# Altium project camera.PrjPCB
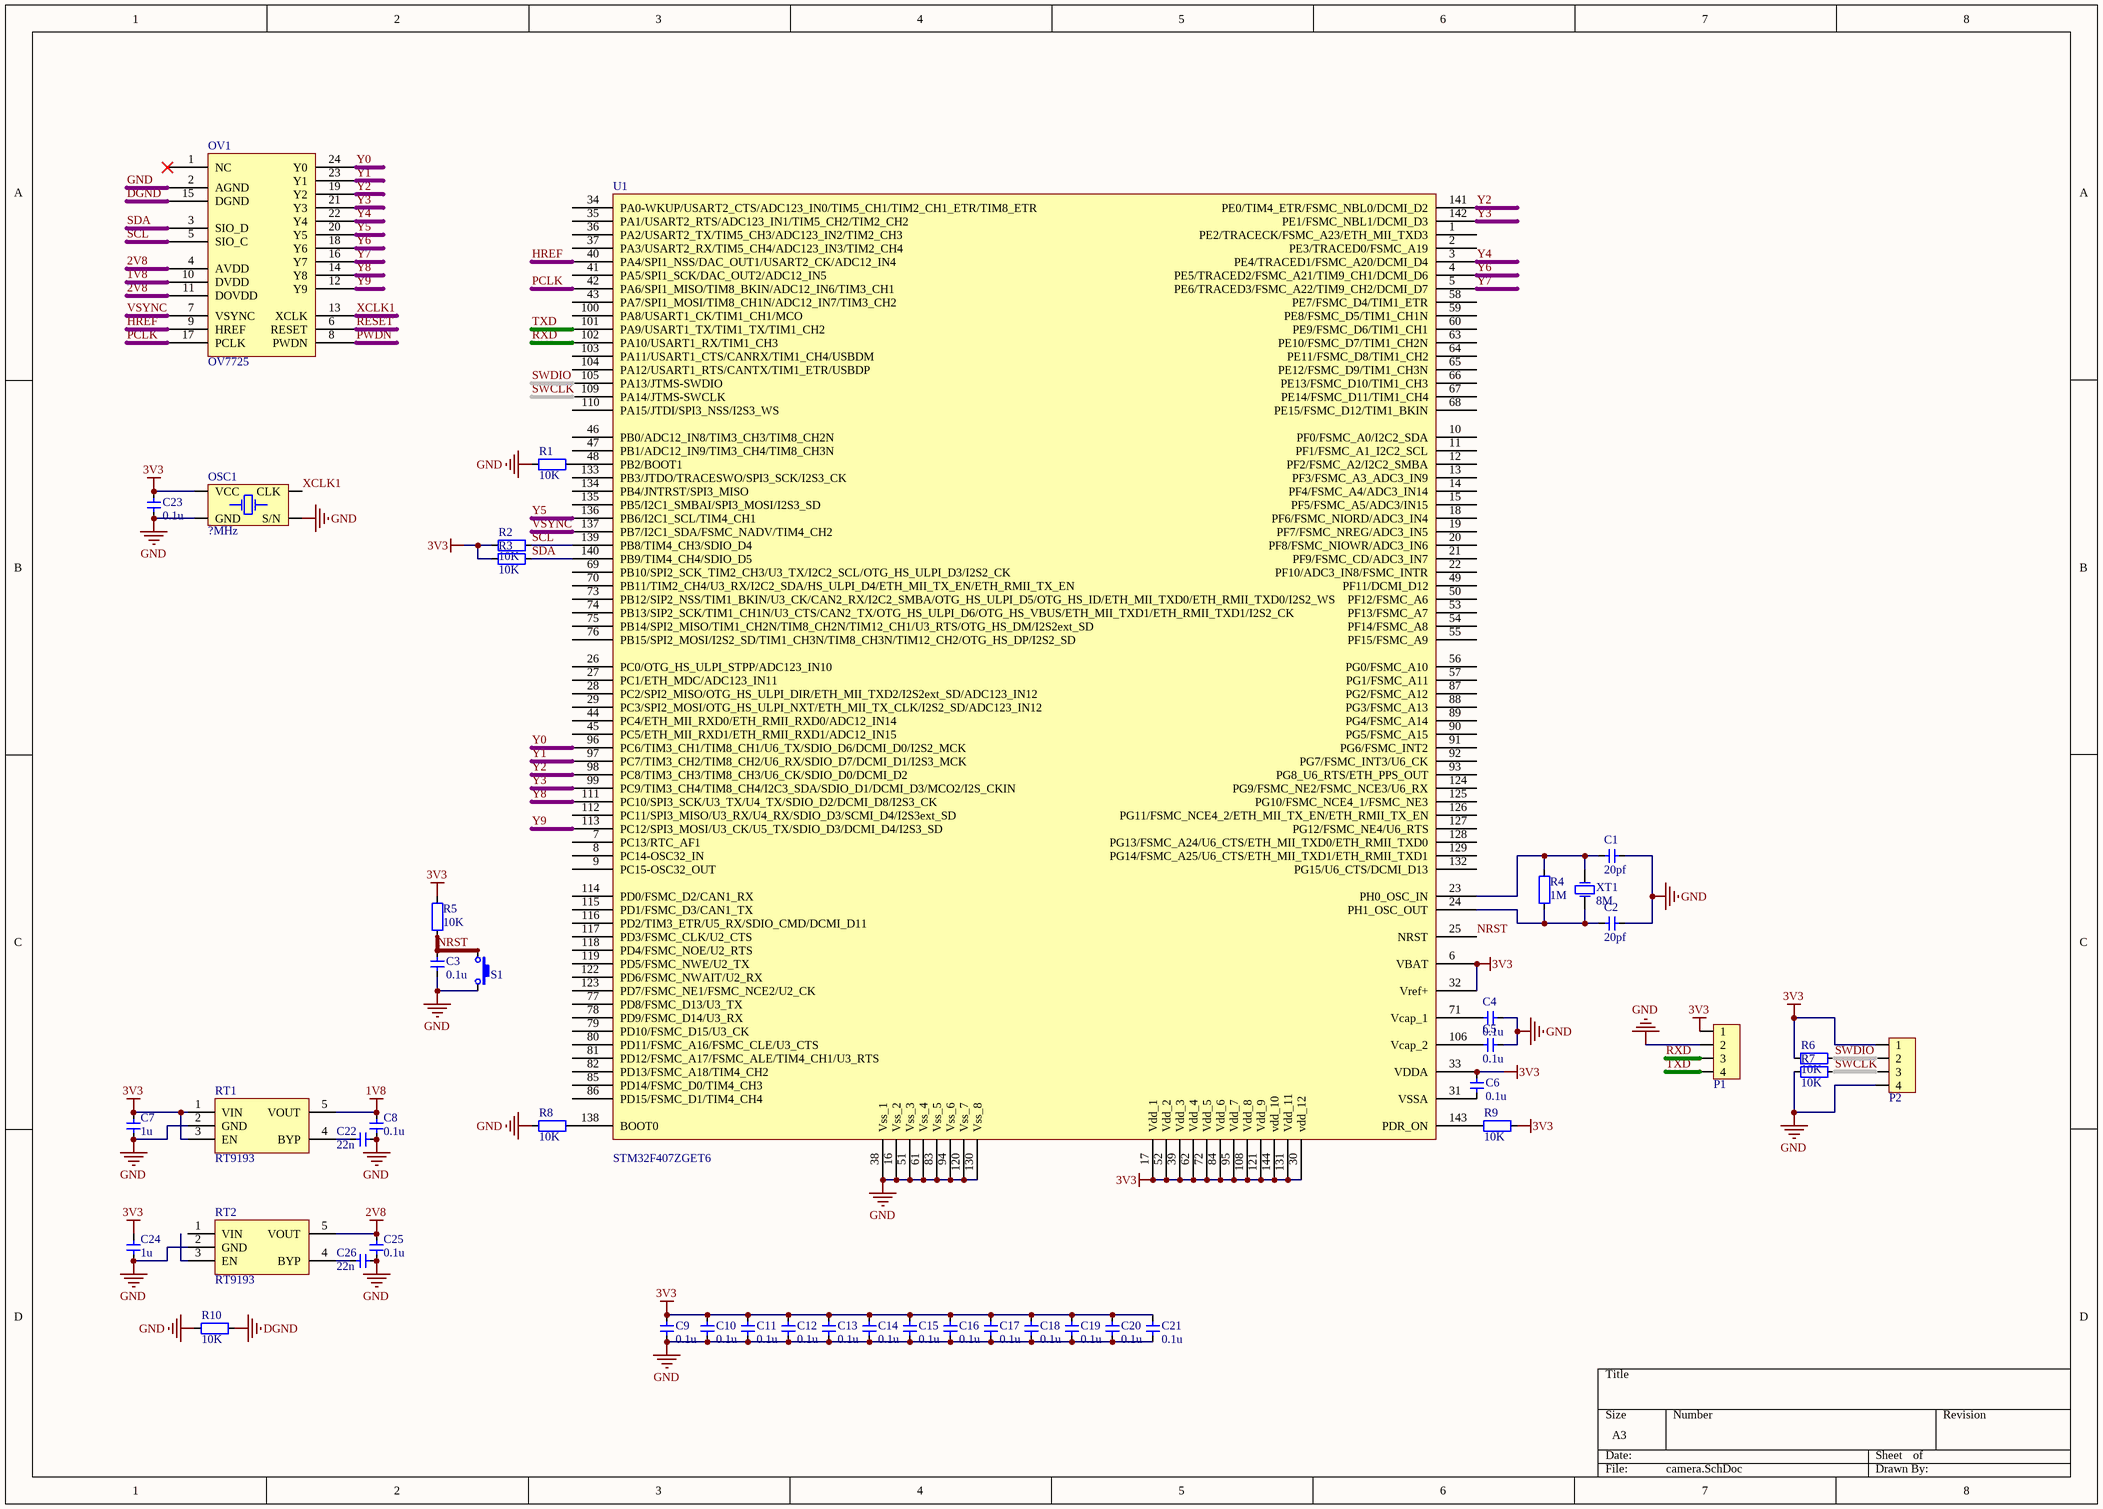
[diagram p0: camera.SchDoc]
1 sheet, 45 parts. Net scope: global (net labels, ports and power ports of the same name join across sheets).
Board file: camera.PcbDoc

## Sheet camera.SchDoc
size A3

### Parts
C1  value 20pf  [CAP_0603]  (hidden comment: Cap_0603)
C2  value 20pf  [CAP_0603]  (hidden comment: Cap_0603)
C3  value 0.1u  [CAP_0603]  (hidden comment: Cap_0603)
C4  value 0.1u  [CAP_0603]  (hidden comment: Cap_0603)
C5  value 0.1u  [CAP_0603]  (hidden comment: Cap_0603)
C6  value 0.1u  [CAP_0603]  (hidden comment: Cap_0603)
C7  value 1u  [CAP_0603]  (hidden comment: Cap_0603)
C8  value 0.1u  [CAP_0603]  (hidden comment: Cap_0603)
C9  value 0.1u  [CAP_0603]  (hidden comment: Cap_0603)
C10  value 0.1u  [CAP_0603]  (hidden comment: Cap_0603)
C11  value 0.1u  [CAP_0603]  (hidden comment: Cap_0603)
C12  value 0.1u  [CAP_0603]  (hidden comment: Cap_0603)
C13  value 0.1u  [CAP_0603]  (hidden comment: Cap_0603)
C14  value 0.1u  [CAP_0603]  (hidden comment: Cap_0603)
C15  value 0.1u  [CAP_0603]  (hidden comment: Cap_0603)
C16  value 0.1u  [CAP_0603]  (hidden comment: Cap_0603)
C17  value 0.1u  [CAP_0603]  (hidden comment: Cap_0603)
C18  value 0.1u  [CAP_0603]  (hidden comment: Cap_0603)
C19  value 0.1u  [CAP_0603]  (hidden comment: Cap_0603)
C20  value 0.1u  [CAP_0603]  (hidden comment: Cap_0603)
C21  value 0.1u  [CAP_0603]  (hidden comment: Cap_0603)
C22  value 22n  [CAP_0603]  (hidden comment: Cap_0603)
C23  value 0.1u  [CAP_0603]  (hidden comment: Cap_0603)
C24  value 1u  [CAP_0603]  (hidden comment: Cap_0603)
C25  value 0.1u  [CAP_0603]  (hidden comment: Cap_0603)
C26  value 22n  [CAP_0603]  (hidden comment: Cap_0603)
OSC1  value ?MHz  [XT_3225_4]  (hidden comment: OSC_3225_4P)
OV1  OV7725  [ov7725]
P1  HDR1x4_2.54  [HDR1X4_2.54_90]  (value not drawn)
P2  HDR1x4_2.54  [HDR1X4_2.54_90]  (value not drawn)
R1  value 10K  [RES_0603]  (hidden comment: Res_0603)
R2  value 10K  [RES_0603]  (hidden comment: Res_0603)
R3  value 10K  [RES_0603]  (hidden comment: Res_0603)
R4  value 1M  [RES_0603]  (hidden comment: Res_0603)
R5  value 10K  [RES_0603]  (hidden comment: Res_0603)
R6  value 10K  [RES_0603]  (hidden comment: Res_0603)
R7  value 10K  [RES_0603]  (hidden comment: Res_0603)
R8  value 10K  [RES_0603]  (hidden comment: Res_0603)
R9  value 10K  [RES_0603]  (hidden comment: Res_0603)
R10  value 10K  [RES_0603]  (hidden comment: Res_0603)
RT1  RT9193  [SOT23-5]
RT2  RT9193  [SOT23-5]
S1  ButtonTACT_3x4x2_180  [ButtonTACT_3x4x2_180H]  (value not drawn)
U1  STM32F407ZGET6  [LQFP_P0.5_144]
XT1  value 8M  [XT_5032_2]  (hidden comment: XTAL_5032_2P)

### Nets
1V8: C8.2 OV1.10(DVDD) RT1.5(VOUT)
2V8: C25.2 OV1.4(AVDD) OV1.11(DOVDD) RT2.5(VOUT)
3V3: C6.1 C7.2 C9.2 C10.2 C11.2 C12.2 C13.2 C14.2 C15.2 C16.2 C17.2 C18.2 C19.2 C20.2 C21.2 C23.2 C24.2 OSC1.4(VCC) P1.1 P2.1 R2.1 R3.1 R5.1 R6.2 R9.2 RT1.1(VIN) RT1.3(EN) U1.6(VBAT) U1.17(Vdd_1) U1.30(vdd_12) U1.32(Vref+) U1.33(VDDA) U1.39(Vdd_3) U1.52(Vdd_2) U1.62(Vdd_4) U1.72(Vdd_5) U1.84(Vdd_6) U1.95(Vdd_7) U1.108(Vdd_8) U1.121(Vdd_9) U1.131(Vdd_11) U1.144(vdd_10)
DGND: OV1.15(DGND) R10.2
GND: C1.1 C2.1 C3.1 C4.1 C5.1 C7.1 C8.1 C9.1 C10.1 C11.1 C12.1 C13.1 C14.1 C15.1 C16.1 C17.1 C18.1 C19.1 C20.1 C21.1 C22.1 C23.1 C24.1 C25.1 C26.1 OSC1.1(S/N) OSC1.2(GND) OV1.2(AGND) P1.2 P2.4 R1.2 R7.2 R8.1 R10.1 RT1.2(GND) RT2.2(GND) S1.2 U1.16(Vss_2) U1.38(Vss_1) U1.51(Vss_3) U1.61(Vss_4) U1.83(Vss_5) U1.94(Vss_6) U1.120(Vss_7) U1.130(Vss_8)
HREF: OV1.9(HREF) U1.40(PA4/SPI1_NSS/DAC_OUT1/USART2_CK/ADC12_IN4)
NRST: C3.2 R5.2 S1.1 U1.25(NRST)
PCLK: OV1.17(PCLK) U1.42(PA6/SPI1_MISO/TIM8_BKIN/ADC12_IN6/TIM3_CH1)
PWDN: OV1.8(PWDN)
RESET: OV1.6(RESET)
RXD: P1.3 U1.102(PA10/USART1_RX/TIM1_CH3)
SCL: OV1.5(SIO_C) R2.2 U1.139(PB8/TIM4_CH3/SDIO_D4)
SDA: OV1.3(SIO_D) R3.2 U1.140(PB9/TIM4_CH4/SDIO_D5)
SWCLK: P2.3 R7.1 U1.109(PA14/JTMS-SWCLK)
SWDIO: P2.2 R6.1 U1.105(PA13/JTMS-SWDIO)
TXD: P1.4 U1.101(PA9/USART1_TX/TIM1_TX/TIM1_CH2)
VSYNC: OV1.7(VSYNC) U1.137(PB7/I2C1_SDA/FSMC_NADV/TIM4_CH2)
XCLK1: OSC1.3(CLK) OV1.13(XCLK)
Y0: OV1.24(Y0) U1.96(PC6/TIM3_CH1/TIM8_CH1/U6_TX/SDIO_D6/DCMI_D0/I2S2_MCK)
Y1: OV1.23(Y1) U1.97(PC7/TIM3_CH2/TIM8_CH2/U6_RX/SDIO_D7/DCMI_D1/I2S3_MCK)
Y2: OV1.19(Y2) U1.98(PC8/TIM3_CH3/TIM8_CH3/U6_CK/SDIO_D0/DCMI_D2) U1.141(PE0/TIM4_ETR/FSMC_NBL0/DCMI_D2)
Y3: OV1.21(Y3) U1.99(PC9/TIM3_CH4/TIM8_CH4/I2C3_SDA/SDIO_D1/DCMI_D3/MCO2/I2S_CKIN) U1.142(PE1/FSMC_NBL1/DCMI_D3)
Y4: OV1.22(Y4) U1.3(PE4/TRACED1/FSMC_A20/DCMI_D4)
Y5: OV1.20(Y5) U1.136(PB6/I2C1_SCL/TIM4_CH1)
Y6: OV1.18(Y6) U1.4(PE5/TRACED2/FSMC_A21/TIM9_CH1/DCMI_D6)
Y7: OV1.16(Y7) U1.5(PE6/TRACED3/FSMC_A22/TIM9_CH2/DCMI_D7)
Y8: OV1.14(Y8) U1.111(PC10/SPI3_SCK/U3_TX/U4_TX/SDIO_D2/DCMI_D8/I2S3_CK)
Y9: OV1.12(Y9) U1.113(PC12/SPI3_MOSI/U3_CK/U5_TX/SDIO_D3/DCMI_D4/I2S3_SD)
NetC1_2: C1.2 R4.1 U1.23(PH0_OSC_IN) XT1.1(OSC1)
NetC2_2: C2.2 R4.2 U1.24(PH1_OSC_OUT) XT1.2(OSC2)
NetC4_2: C4.2 U1.71(Vcap_1)
NetC5_2: C5.2 U1.106(Vcap_2)
NetC6_2: C6.2 U1.31(VSSA)
NetC22_2: C22.2 RT1.4(BYP)
NetC26_2: C26.2 RT2.4(BYP)
NetR1_1: R1.1 U1.48(PB2/BOOT1)
NetR8_2: R8.2 U1.138(BOOT0)
NetR9_1: R9.1 U1.143(PDR_ON)

Not connected (* = marked no-connect by the designer): OV1 1(NC)*; RT2 1(VIN) 3(EN); U1 1(PE2/TRACECK/FSMC_A23/ETH_MII_TXD3) 2(PE3/TRACED0/FSMC_A19) 7(PC13/RTC_AF1) 8(PC14-OSC32_IN) 9(PC15-OSC32_OUT) 10(PF0/FSMC_A0/I2C2_SDA) 11(PF1/FSMC_A1_I2C2_SCL) 12(PF2/FSMC_A2/I2C2_SMBA) 13(PF3/FSMC_A3_ADC3_IN9) 14(PF4/FSMC_A4/ADC3_IN14) 15(PF5/FSMC_A5/ADC3/IN15) 18(PF6/FSMC_NIORD/ADC3_IN4) 19(PF7/FSMC_NREG/ADC3_IN5) 20(PF8/FSMC_NIOWR/ADC3_IN6) 21(PF9/FSMC_CD/ADC3_IN7) 22(PF10/ADC3_IN8/FSMC_INTR) 26(PC0/OTG_HS_ULPI_STPP/ADC123_IN10) 27(PC1/ETH_MDC/ADC123_IN11) 28(PC2/SPI2_MISO/OTG_HS_ULPI_DIR/ETH_MII_TXD2/I2S2ext_SD/ADC123_IN12) 29(PC3/SPI2_MOSI/OTG_HS_ULPI_NXT/ETH_MII_TX_CLK/I2S2_SD/ADC123_IN12) 34(PA0-WKUP/USART2_CTS/ADC123_IN0/TIM5_CH1/TIM2_CH1_ETR/TIM8_ETR) 35(PA1/USART2_RTS/ADC123_IN1/TIM5_CH2/TIM2_CH2) 36(PA2/USART2_TX/TIM5_CH3/ADC123_IN2/TIM2_CH3) 37(PA3/USART2_RX/TIM5_CH4/ADC123_IN3/TIM2_CH4) 41(PA5/SPI1_SCK/DAC_OUT2/ADC12_IN5) 43(PA7/SPI1_MOSI/TIM8_CH1N/ADC12_IN7/TIM3_CH2) 44(PC4/ETH_MII_RXD0/ETH_RMII_RXD0/ADC12_IN14) 45(PC5/ETH_MII_RXD1/ETH_RMII_RXD1/ADC12_IN15) 46(PB0/ADC12_IN8/TIM3_CH3/TIM8_CH2N) 47(PB1/ADC12_IN9/TIM3_CH4/TIM8_CH3N) 49(PF11/DCMI_D12) 50(PF12/FSMC_A6) 53(PF13/FSMC_A7) 54(PF14/FSMC_A8) 55(PF15/FSMC_A9) 56(PG0/FSMC_A10) 57(PG1/FSMC_A11) 58(PE7/FSMC_D4/TIM1_ETR) 59(PE8/FSMC_D5/TIM1_CH1N) 60(PE9/FSMC_D6/TIM1_CH1) 63(PE10/FSMC_D7/TIM1_CH2N) 64(PE11/FSMC_D8/TIM1_CH2) 65(PE12/FSMC_D9/TIM1_CH3N) 66(PE13/FSMC_D10/TIM1_CH3) 67(PE14/FSMC_D11/TIM1_CH4) 68(PE15/FSMC_D12/TIM1_BKIN) 69(PB10/SPI2_SCK_TIM2_CH3/U3_TX/I2C2_SCL/OTG_HS_ULPI_D3/I2S2_CK) 70(PB11/TIM2_CH4/U3_RX/I2C2_SDA/HS_ULPI_D4/ETH_MII_TX_EN/ETH_RMII_TX_EN) 73(PB12/SIP2_NSS/TIM1_BKIN/U3_CK/CAN2_RX/I2C2_SMBA/OTG_HS_ULPI_D5/OTG_HS_ID/ETH_MII_TXD0/ETH_RMII_TXD0/I2S2_WS) 74(PB13/SIP2_SCK/TIM1_CH1N/U3_CTS/CAN2_TX/OTG_HS_ULPI_D6/OTG_HS_VBUS/ETH_MII_TXD1/ETH_RMII_TXD1/I2S2_CK) 75(PB14/SPI2_MISO/TIM1_CH2N/TIM8_CH2N/TIM12_CH1/U3_RTS/OTG_HS_DM/I2S2ext_SD) 76(PB15/SPI2_MOSI/I2S2_SD/TIM1_CH3N/TIM8_CH3N/TIM12_CH2/OTG_HS_DP/I2S2_SD) 77(PD8/FSMC_D13/U3_TX) 78(PD9/FSMC_D14/U3_RX) 79(PD10/FSMC_D15/U3_CK) 80(PD11/FSMC_A16/FSMC_CLE/U3_CTS) 81(PD12/FSMC_A17/FSMC_ALE/TIM4_CH1/U3_RTS) 82(PD13/FSMC_A18/TIM4_CH2) 85(PD14/FSMC_D0/TIM4_CH3) 86(PD15/FSMC_D1/TIM4_CH4) 87(PG2/FSMC_A12) 88(PG3/FSMC_A13) 89(PG4/FSMC_A14) 90(PG5/FSMC_A15) 91(PG6/FSMC_INT2) 92(PG7/FSMC_INT3/U6_CK) 93(PG8_U6_RTS/ETH_PPS_OUT) 100(PA8/USART1_CK/TIM1_CH1/MCO) 103(PA11/USART1_CTS/CANRX/TIM1_CH4/USBDM) 104(PA12/USART1_RTS/CANTX/TIM1_ETR/USBDP) 110(PA15/JTDI/SPI3_NSS/I2S3_WS) 112(PC11/SPI3_MISO/U3_RX/U4_RX/SDIO_D3/SCMI_D4/I2S3ext_SD) 114(PD0/FSMC_D2/CAN1_RX) 115(PD1/FSMC_D3/CAN1_TX) 116(PD2/TIM3_ETR/U5_RX/SDIO_CMD/DCMI_D11) 117(PD3/FSMC_CLK/U2_CTS) 118(PD4/FSMC_NOE/U2_RTS) 119(PD5/FSMC_NWE/U2_TX) 122(PD6/FSMC_NWAIT/U2_RX) 123(PD7/FSMC_NE1/FSMC_NCE2/U2_CK) 124(PG9/FSMC_NE2/FSMC_NCE3/U6_RX) 125(PG10/FSMC_NCE4_1/FSMC_NE3) 126(PG11/FSMC_NCE4_2/ETH_MII_TX_EN/ETH_RMII_TX_EN) 127(PG12/FSMC_NE4/U6_RTS) 128(PG13/FSMC_A24/U6_CTS/ETH_MII_TXD0/ETH_RMII_TXD0) 129(PG14/FSMC_A25/U6_CTS/ETH_MII_TXD1/ETH_RMII_TXD1) 132(PG15/U6_CTS/DCMI_D13) 133(PB3/JTDO/TRACESWO/SPI3_SCK/I2S3_CK) 134(PB4/JNTRST/SPI3_MISO) 135(PB5/I2C1_SMBAI/SPI3_MOSI/I2S3_SD)

### Library data of the parts
C1-C26 = Cap_0603: Capacitor
OSC1 = OSC_3225_4P: Crystal Oscillator
P1 P2 = HDR1x4_2.54: Header
R1-R10 = Res_0603: Resistor
RT1 RT2 = RT9193: Power
S1 = ButtonTACT_3x4x2_180: Button
U1 = Component_1
XT1 = XTAL_5032_2P: Crystal Oscillator